# EAGLE design ELDimmer (EAGLE 7.7.0)
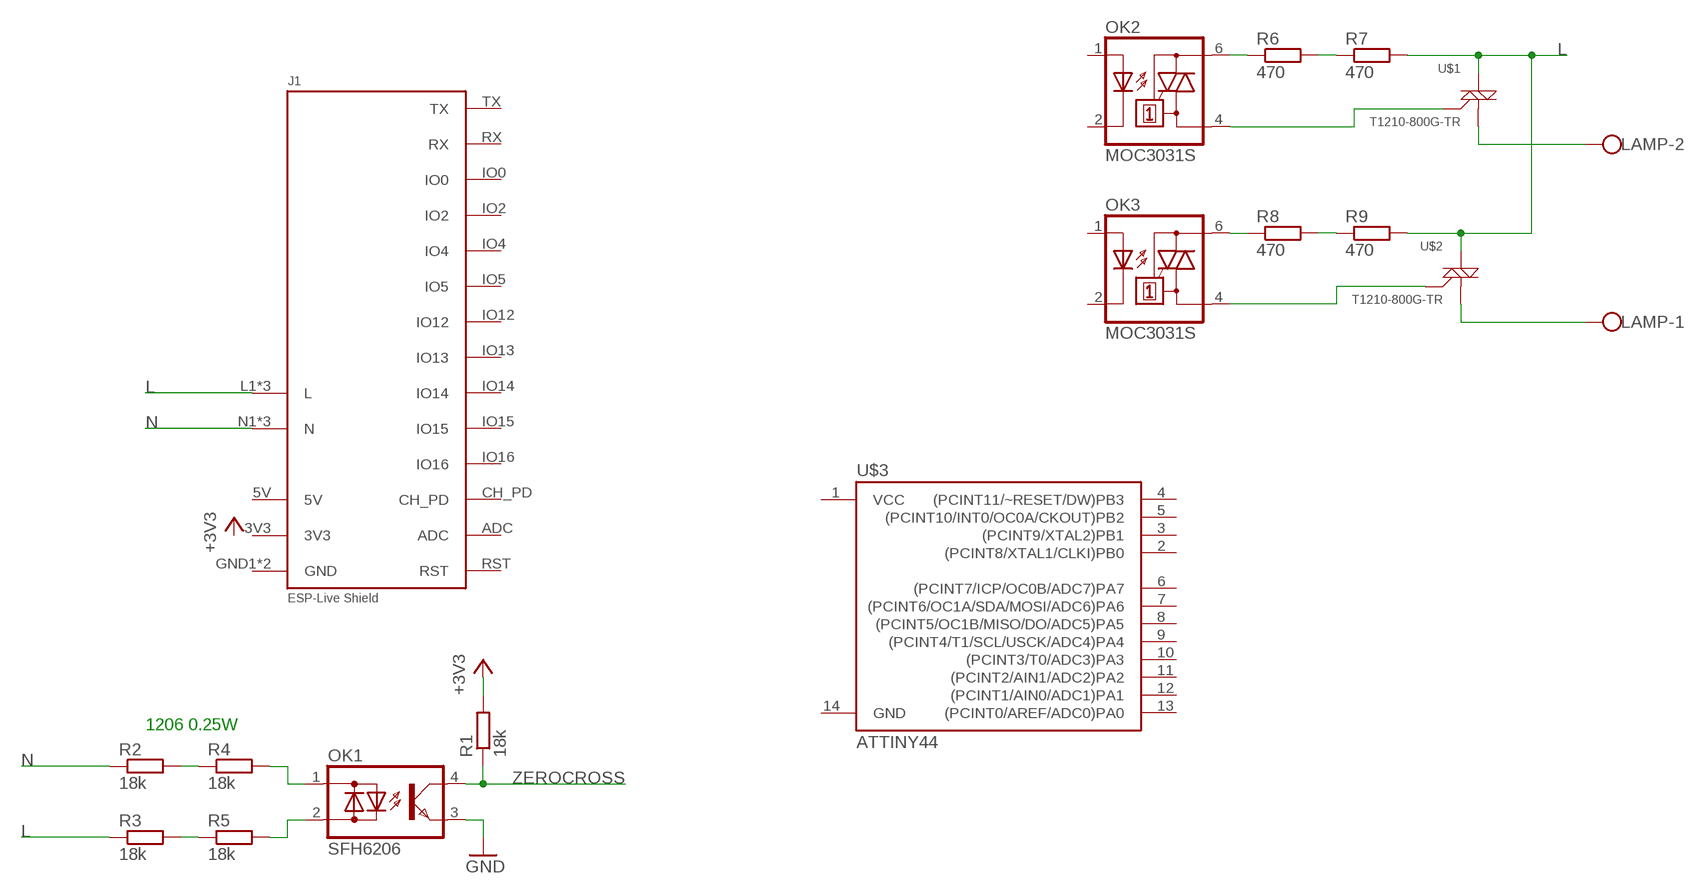
[diagram p0: schematic, sheet 1]

## Parts
J1  ESP-LIVE-SHIELD  [ESP-LIVE-SHIELD]
LAMP  W237-102  [W237-102]
OK1  SFH6206  [DIL4-SMD]
OK2  MOC3031S  [DIL6-SMD]
OK3  MOC3031S  [DIL6-SMD]
R1  18k  R-EU_R1206  [R1206]
R2  18k  R-EU_R1206  [R1206]
R3  18k  R-EU_R1206  [R1206]
R4  18k  R-EU_R1206  [R1206]
R5  18k  R-EU_R1206  [R1206]
R6  470  R-EU_R1206  [R1206]
R7  470  R-EU_R1206  [R1206]
R8  470  R-EU_R1206  [R1206]
R9  470  R-EU_R1206  [R1206]
U$1  T1210-800G-TR  [D2PAK]
U$2  T1210-800G-TR  [D2PAK]
U$3  ATTINY44  ATTINY84  [SO14]

## Nets
+3V3: R1.2
GND: OK1.3(E)
L: J1.L1(L) J1.L2(L) J1.L3(L) R3.1 R7.2 R9.2 U$1.2(A2) U$1.TAB(A2) U$2.2(A2) U$2.TAB(A2)
N: J1.N1(N) J1.N2(N) J1.N3(N) R2.1
N$1: R2.2 R4.1
N$2: R3.2 R5.1
N$3: OK1.1(AC1) R4.2
N$4: OK1.2(AC2) R5.2
N$5: R6.2 R7.1
N$6: R8.2 R9.1
N$7: OK2.6(A2) R6.1
N$8: OK2.4(A1) U$1.3(G)
N$9: LAMP.2 U$1.1(A1)
N$10: LAMP.1 U$2.1(A1)
N$11: OK3.4(A1) U$2.3(G)
N$12: OK3.6(A2) R8.1
ZEROCROSS: OK1.4(C) R1.1
Unconnected: J1.ADC J1.CH_PD J1.IO0 J1.IO2 J1.IO4 J1.IO5 J1.IO12 J1.IO13 J1.IO14 J1.IO15 J1.IO16 J1.RST J1.RX J1.TX OK2.1(A) OK2.2(C) OK3.1(A) OK3.2(C) U$3.1(VCC) U$3.2((PCINT8/XTAL1/CLKI)PB0) U$3.3((PCINT9/XTAL2)PB1) U$3.4((PCINT11/~RESET/DW)PB3) U$3.5((PCINT10/INT0/OC0A/CKOUT)PB2) U$3.6((PCINT7/ICP/OC0B/ADC7)PA7) U$3.7((PCINT6/OC1A/SDA/MOSI/ADC6)PA6) U$3.8((PCINT5/OC1B/MISO/DO/ADC5)PA5) U$3.9((PCINT4/T1/SCL/USCK/ADC4)PA4) U$3.10((PCINT3/T0/ADC3)PA3) U$3.11((PCINT2/AIN1/ADC2)PA2) U$3.12((PCINT1/AIN0/ADC1)PA1) U$3.13((PCINT0/AREF/ADC0)PA0) U$3.14(GND)

## Notes on the sheet
- 1206 0.25W

## Power pins joined to a net without a drawn wire
3V3: J1.3V3
5V: J1.5V
GND: J1.GND1(GND) J1.GND2(GND)

## Library data of the parts
J1 = ESP-Live Shield:ESP-LIVE-SHIELD: A shield to mount underneath the ESP-Live board. The Live terminal is fused on the ESP-Live board. Neutral is connected directly to the mains. Extremem caution must be used with these pins! At least 5mm clearance must be provided if they are not used. This is marked on the PCB layout. The 5V pin is able to supply up to 1.5W. The 3.3V pin has limited supply current of around 50mA since it is used by the ESP-12F module.
LAMP = con-wago-500:W237-102: WAGO SCREW CLAMP; MPN: 237-102; OC_FARNELL: unknown; OC_NEWARK: 70K9898
OK1 = optocoupler:SFH620: Optocoupler, Phototransistor Output, AC Input Source: http://www.vishay.com/docs/83675/sfh620.pdf; MF: VISHAY/TELEFUNKEN; MPN: SFH6206-3; OC_FARNELL: 1469585; OC_NEWARK: 58K2214
OK2 OK3 = optocoupler:MOC30*: 6-Pin DIP Zero-Cross Optoisolators Triac Driver Output (250/400 Volt Peak) Source: Data sheet <http://www.fairchildsemi.com/ds/MO/MOC3031M.pdf> The old path of data sheet not more available 2013-05-06.; MF: FAIRCHILD SEMICONDUCTOR; MPN: MOC3031SM; OC_FARNELL: unknown; OC_NEWARK: 34C1335
R1-R9 = rcl:R-EU_: RESISTOR, European symbol
U$1 U$2 = Custom:T1210-800G-TR: Snubberless 12A 600V
U$3 = SparkFun-DigitalIC:ATTINY84: Atmel 14-pin 2/4/8kB flash uC; PROD_ID: IC-11285

## Board
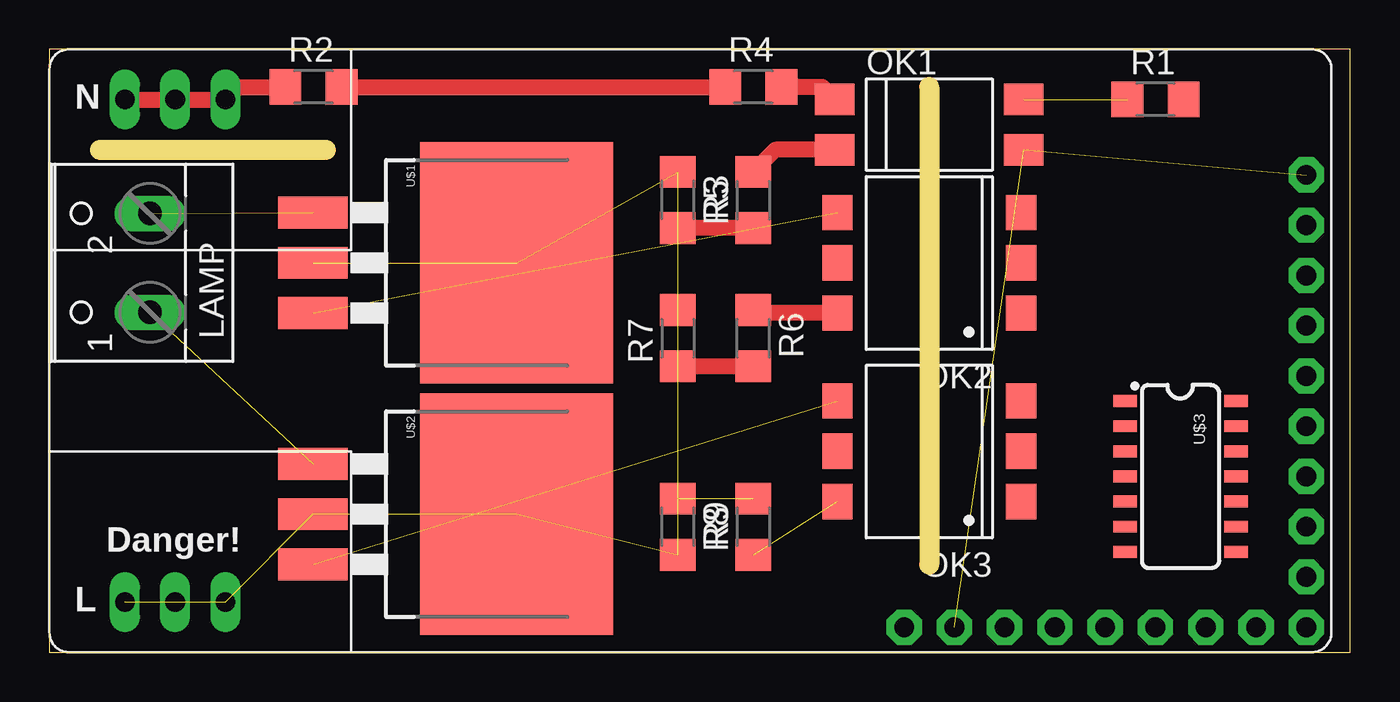
[diagram p1: board, top side]
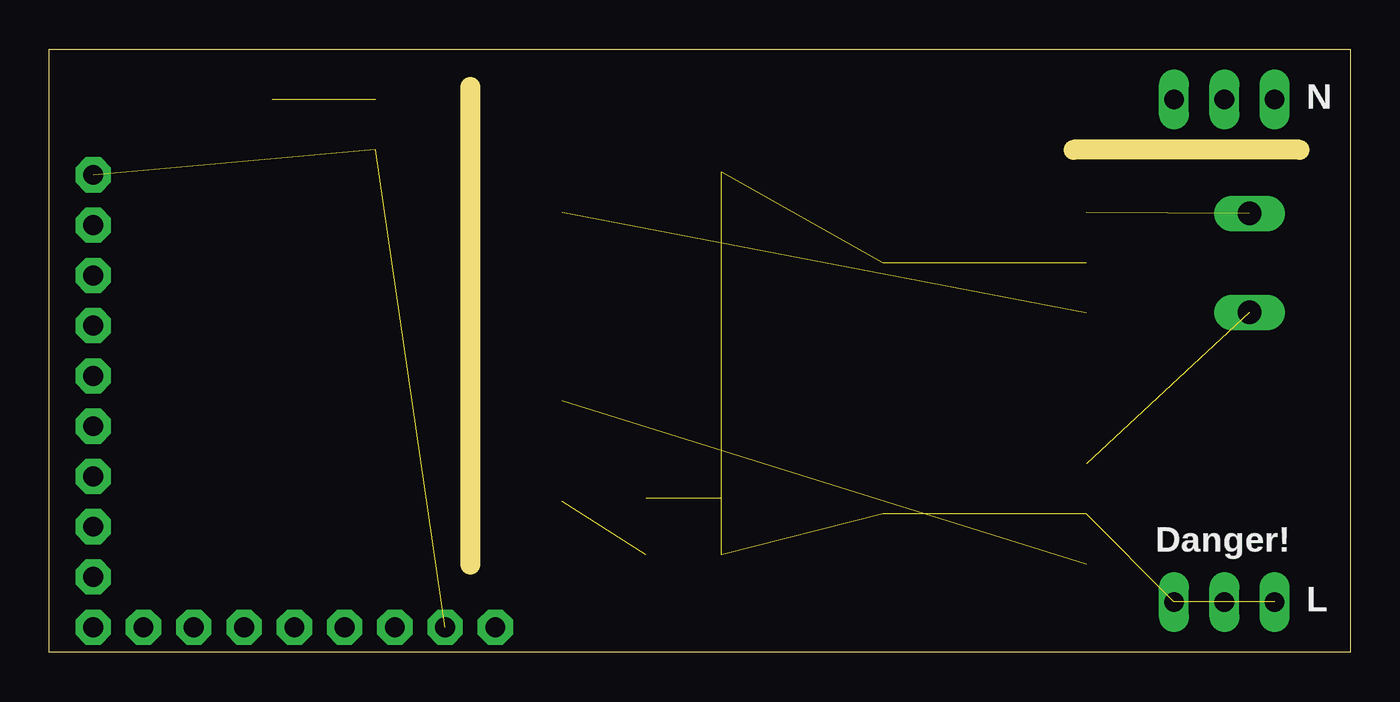
[diagram p2: board, bottom side, seen from below]

Size 65.71 x 30.47 mm. Coordinates in mm from the lower left corner, seen from the top.
Outline: 0,0 65.71,0 65.71,30.47 0,30.47 0,0
Copper layers (1*16): Top 0.035mm / dielectric 1.5mm / Bottom 0.035mm
Design rules "default": minimum track width 10mil, minimum drill 24mil, track to track 8mil, track to pad 8mil, pad to pad 8mil, via to via 8mil, smd to smd 8mil, copper to edge 40mil, drill to drill 8mil, minimum pad ring 10mil, minimum via ring 8mil, stop-mask expansion 4mil, vias tented up to drill 0mil, thermal gap 10mil
Milling: 2 lines

### Footprints (pad centres in the part's own frame; a part is rotated, then mirrored left to right if it is on the bottom)
ESP-LIVE-SHIELD = drill 1 pad 1.778 octagon: 3V3 48.26,1.27; 5V 43.18,1.27; ADC 63.5,1.27; CH_PD 60.96,1.27; GND1 45.72,1.27; GND2 63.5,24.13; IO0 63.5,11.43; IO2 63.5,8.89; IO4 63.5,13.97; IO5 63.5,16.51; IO12 53.34,1.27; IO13 50.8,1.27; IO14 55.88,1.27; IO15 63.5,6.35; IO16 58.42,1.27; RST 63.5,3.81; RX 63.5,19.05; TX 63.5,21.59 | drill 1 long: L1 3.81,2.54; L2 6.35,2.54; L3 8.89,2.54; N1 3.81,27.94; N2 6.35,27.94; N3 8.89,27.94
W237-102 = drill 1.194 long: 1 -2.5,-1.27; 2 2.5,-1.27
DIL4-SMD = smd 1.6 x 2: 1 -1.27,-4.77; 2 1.27,-4.77; 3 1.27,4.77; 4 -1.27,4.77
DIL6-SMD = smd 1.78 x 1.52: 1 -2.54,-4.645; 2 0,-4.645; 3 2.54,-4.645; 4 2.54,4.645; 5 0,4.645; 6 -2.54,4.645
R1206 = smd 1.6 x 1.803: 1 -1.422,0; 2 1.422,0
D2PAK = smd 1.6 x 3.5: 1 -2.54,-4.465; 2 0,-4.465; 3 2.54,-4.465 | smd 12.2 x 9.75: TAB 0,5.81
SO14 = smd 0.6 x 1.2: 1 -3.81,-2.8; 2 -2.54,-2.8; 3 -1.27,-2.8; 4 0,-2.8; 5 1.27,-2.8; 6 2.54,-2.8; 7 3.81,-2.8; 8 3.81,2.8; 9 2.54,2.8; 10 1.27,2.8; 11 0,2.8; 12 -1.27,2.8; 13 -2.54,2.8; 14 -3.81,2.8

### Placement (x,y rotation side)
J1  0,0 0 top
LAMP  3.81,19.68 90 top
OK1  44.45,26.67 270 top
OK2  44.45,19.68 90 top
OK3  44.45,10.16 90 top
R1  55.88,27.94 0 top
R2  13.34,28.57 0 top
R3  31.75,22.86 270 top
R4  35.56,28.57 0 top
R5  35.56,22.86 90 top
R6  35.56,15.88 270 top
R7  31.75,15.88 90 top
R8  35.56,6.35 90 top
R9  31.75,6.35 270 top
U$1  17.78,19.68 270 top
U$2  17.78,6.99 270 top
U$3  57.15,8.89 270 top

### Tracks (layer width: path | path; a pad name or v marks a point on that pad's centre or on a via)
GND  (2 unrouted)
L  (9 unrouted)
N
  Top 0.813: J1.N1 J1.N2 J1.N3 9.53,28.57 R2.1
N$1
  Top 0.813: R2.2 R4.1
N$2
  Top 0.813: R5.1 R3.2
N$3
  Top 0.813: OK1.1 39.05,28.57 R4.2
N$4
  Top 0.813: OK1.2 36.68,25.4 R5.2
N$5
  Top 0.813: R6.2 R7.1
N$6  (1 unrouted)
N$7
  Top 0.813: OK2.6 36.04,17.14 R6.1
N$8  (1 unrouted)
N$9  (1 unrouted)
N$10  (1 unrouted)
N$11  (1 unrouted)
N$12  (1 unrouted)
ZEROCROSS  (1 unrouted)